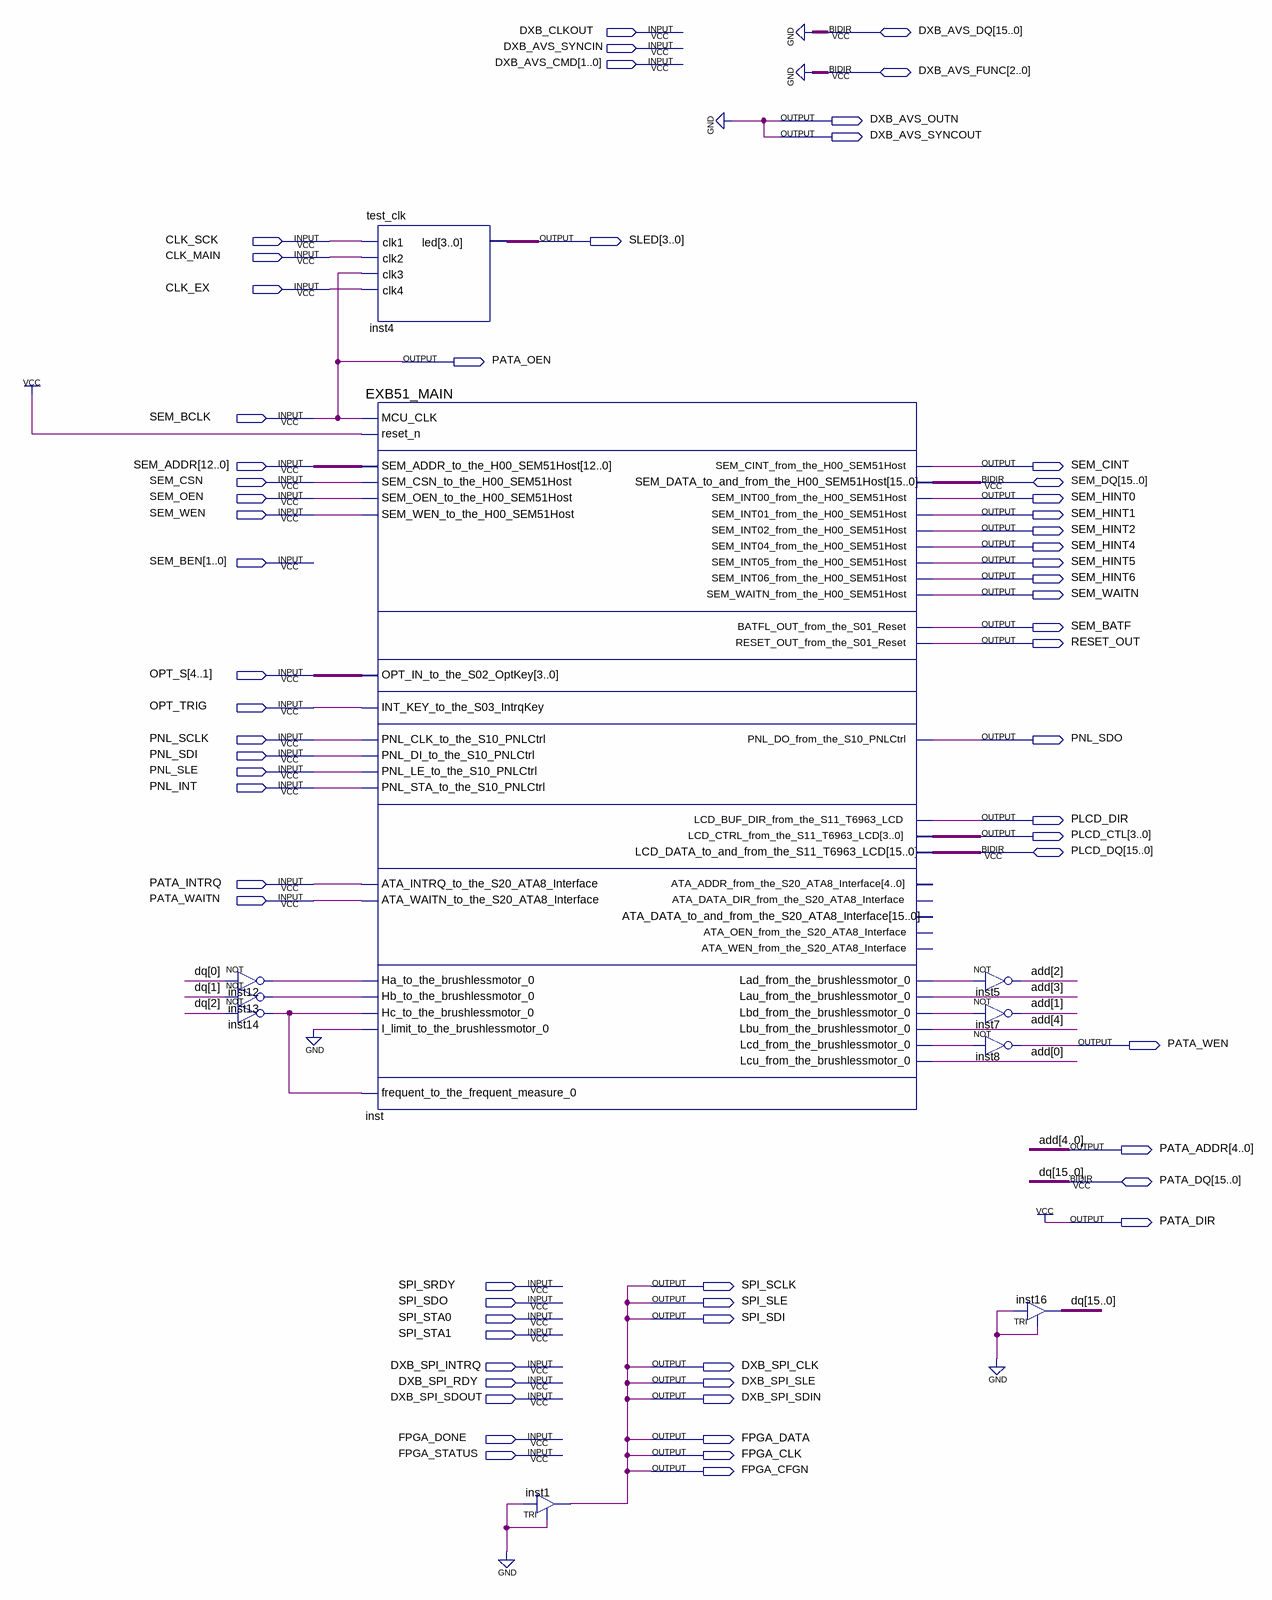
[diagram p0: schematic sheet]
// Quartus schematic EXB-100-U1.bdf as structural Verilog: 10 symbols, 63 pins
module \EXB-100-U1  (
  input  DXB_CLKOUT,
  input  DXB_AVS_SYNCIN,
  input  [1:0] DXB_AVS_CMD,
  input  CLK_SCK,
  input  CLK_MAIN,
  input  CLK_EX,
  input  SEM_BCLK,
  input  [12:0] SEM_ADDR,
  input  SEM_CSN,
  input  SEM_OEN,
  input  SEM_WEN,
  input  [1:0] SEM_BEN,
  input  [4:1] OPT_S,
  input  OPT_TRIG,
  input  PNL_SCLK,
  input  PNL_SDI,
  input  PNL_SLE,
  input  PNL_INT,
  input  PATA_INTRQ,
  input  PATA_WAITN,
  input  SPI_SRDY,
  input  SPI_SDO,
  input  SPI_STA0,
  input  SPI_STA1,
  input  DXB_SPI_INTRQ,
  input  DXB_SPI_RDY,
  input  DXB_SPI_SDOUT,
  input  FPGA_DONE,
  input  FPGA_STATUS,
  inout  [15:0] DXB_AVS_DQ,
  inout  [2:0] DXB_AVS_FUNC,
  inout  [15:0] SEM_DQ,
  inout  [15:0] PLCD_DQ,
  inout  [15:0] PATA_DQ,
  output DXB_AVS_OUTN,
  output DXB_AVS_SYNCOUT,
  output [3:0] SLED,
  output PATA_OEN,
  output SEM_CINT,
  output SEM_HINT0,
  output SEM_HINT1,
  output SEM_HINT2,
  output SEM_HINT4,
  output SEM_HINT5,
  output SEM_HINT6,
  output SEM_WAITN,
  output SEM_BATF,
  output RESET_OUT,
  output PNL_SDO,
  output PLCD_DIR,
  output [3:0] PLCD_CTL,
  output PATA_WEN,
  output [4:0] PATA_ADDR,
  output PATA_DIR,
  output SPI_SCLK,
  output SPI_SLE,
  output SPI_SDI,
  output DXB_SPI_CLK,
  output DXB_SPI_SLE,
  output DXB_SPI_SDIN,
  output FPGA_DATA,
  output FPGA_CLK,
  output FPGA_CFGN
);

  wire inst12_out, inst13_out, inst14_out, inst_lad_from_the_brushlessmotor_0,
       inst_lbd_from_the_brushlessmotor_0, inst_lcd_from_the_brushlessmotor_0;

  not inst12 (inst12_out, PATA_DQ[0]);
  not inst13 (inst13_out, PATA_DQ[1]);
  not inst14 (inst14_out, PATA_DQ[2]);
  test_clk inst4 (.clk1(CLK_SCK), .clk2(CLK_MAIN), .clk3(SEM_BCLK), .clk4(CLK_EX), .led(SLED));
  EXB51_MAIN inst (
    .MCU_CLK(SEM_BCLK), .reset_n(1'b1), .SEM_ADDR_to_the_H00_SEM51Host(SEM_ADDR),
    .SEM_CSN_to_the_H00_SEM51Host(SEM_CSN), .SEM_OEN_to_the_H00_SEM51Host(SEM_OEN),
    .SEM_WEN_to_the_H00_SEM51Host(SEM_WEN), .OPT_IN_to_the_S02_OptKey(OPT_S),
    .INT_KEY_to_the_S03_IntrqKey(OPT_TRIG), .PNL_CLK_to_the_S10_PNLCtrl(PNL_SCLK),
    .PNL_DI_to_the_S10_PNLCtrl(PNL_SDI), .PNL_LE_to_the_S10_PNLCtrl(PNL_SLE),
    .PNL_STA_to_the_S10_PNLCtrl(PNL_INT), .ATA_INTRQ_to_the_S20_ATA8_Interface(PATA_INTRQ),
    .ATA_WAITN_to_the_S20_ATA8_Interface(PATA_WAITN), .Ha_to_the_brushlessmotor_0(inst12_out),
    .Hb_to_the_brushlessmotor_0(inst13_out), .Hc_to_the_brushlessmotor_0(inst14_out),
    .I_limit_to_the_brushlessmotor_0(1'b0), .frequent_to_the_frequent_measure_0(inst14_out),
    .SEM_CINT_from_the_H00_SEM51Host(SEM_CINT), .SEM_INT00_from_the_H00_SEM51Host(SEM_HINT0),
    .SEM_INT01_from_the_H00_SEM51Host(SEM_HINT1), .SEM_INT02_from_the_H00_SEM51Host(SEM_HINT2),
    .SEM_INT04_from_the_H00_SEM51Host(SEM_HINT4), .SEM_INT05_from_the_H00_SEM51Host(SEM_HINT5),
    .SEM_INT06_from_the_H00_SEM51Host(SEM_HINT6), .SEM_WAITN_from_the_H00_SEM51Host(SEM_WAITN),
    .BATFL_OUT_from_the_S01_Reset(SEM_BATF), .RESET_OUT_from_the_S01_Reset(RESET_OUT),
    .PNL_DO_from_the_S10_PNLCtrl(PNL_SDO), .LCD_BUF_DIR_from_the_S11_T6963_LCD(PLCD_DIR),
    .LCD_CTRL_from_the_S11_T6963_LCD(PLCD_CTL),
    .Lad_from_the_brushlessmotor_0(inst_lad_from_the_brushlessmotor_0),
    .Lau_from_the_brushlessmotor_0(PATA_ADDR[3]),
    .Lbd_from_the_brushlessmotor_0(inst_lbd_from_the_brushlessmotor_0),
    .Lbu_from_the_brushlessmotor_0(PATA_ADDR[4]),
    .Lcd_from_the_brushlessmotor_0(inst_lcd_from_the_brushlessmotor_0),
    .Lcu_from_the_brushlessmotor_0(PATA_ADDR[0]), .SEM_DATA_to_and_from_the_H00_SEM51Host(SEM_DQ),
    .LCD_DATA_to_and_from_the_S11_T6963_LCD(PLCD_DQ));  // open: ATA_ADDR_from_the_S20_ATA8_Interface, ATA_DATA_DIR_from_the_S20_ATA8_Interface, ATA_OEN_from_the_S20_ATA8_Interface, ATA_WEN_from_the_S20_ATA8_Interface, ATA_DATA_to_and_from_the_S20_ATA8_Interface
  TRI inst1 (.IN(1'b0), .OE(1'b0), .OUT(DXB_SPI_CLK));
  not inst5 (PATA_ADDR[2], inst_lad_from_the_brushlessmotor_0);
  not inst7 (PATA_ADDR[1], inst_lbd_from_the_brushlessmotor_0);
  not inst8 (PATA_WEN, inst_lcd_from_the_brushlessmotor_0);
  TRI inst16[15:0] (.IN(1'b0), .OE(1'b0), .OUT(PATA_DQ));

  assign DXB_AVS_OUTN = 1'b0;
  assign DXB_AVS_SYNCOUT = 1'b0;
  assign DXB_SPI_SDIN = DXB_SPI_CLK;
  assign DXB_SPI_SLE = DXB_SPI_CLK;
  assign FPGA_CFGN = DXB_SPI_CLK;
  assign FPGA_CLK = DXB_SPI_CLK;
  assign FPGA_DATA = DXB_SPI_CLK;
  assign PATA_DIR = 1'b1;
  assign PATA_OEN = SEM_BCLK;
  assign SPI_SCLK = DXB_SPI_CLK;
  assign SPI_SDI = DXB_SPI_CLK;
  assign SPI_SLE = DXB_SPI_CLK;
  // also tied to GND on the sheet: {DXB_AVS_DQ[0], DXB_AVS_DQ[1], DXB_AVS_DQ[2], DXB_AVS_DQ[3], DXB_AVS_DQ[4], DXB_AVS_DQ[5], DXB_AVS_DQ[6], DXB_AVS_DQ[7], DXB_AVS_DQ[8], DXB_AVS_DQ[9], DXB_AVS_DQ[10], DXB_AVS_DQ[11], DXB_AVS_DQ[12], DXB_AVS_DQ[13], DXB_AVS_DQ[14], DXB_AVS_DQ[15], DXB_AVS_FUNC[0], DXB_AVS_FUNC[1], DXB_AVS_FUNC[2]}

  // Other names for the same wires on the sheet: add[4:0] = PATA_ADDR; dq[15:0] = PATA_DQ
endmodule
